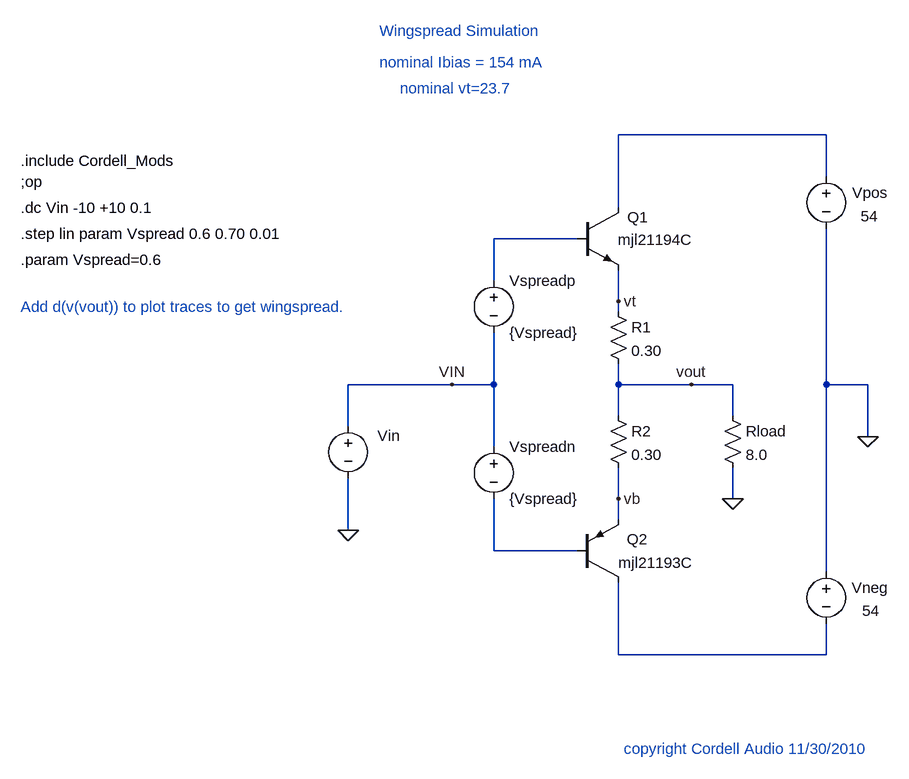
[diagram p0: schematic Wingspread.asc]
Wingspread.asc, the LTspice schematic file:
Version 4
SHEET 1 2428 1336
WIRE 320 240 0 240
WIRE 320 304 320 240
WIRE 0 352 0 240
WIRE -64 400 -192 400
WIRE -192 464 -192 400
WIRE 0 496 0 448
WIRE 0 512 0 496
WIRE -256 624 -416 624
WIRE -192 624 -192 544
WIRE -192 624 -256 624
WIRE 0 624 0 592
WIRE 112 624 0 624
WIRE 176 624 112 624
WIRE 320 624 320 384
WIRE 384 624 320 624
WIRE 0 672 0 624
WIRE 176 672 176 624
WIRE -416 688 -416 624
WIRE 384 704 384 624
WIRE -192 720 -192 624
WIRE 0 800 0 752
WIRE 176 800 176 752
WIRE 0 832 0 800
WIRE -416 848 -416 768
WIRE -192 880 -192 800
WIRE -64 880 -192 880
WIRE 320 912 320 624
WIRE 0 1040 0 928
WIRE 320 1040 320 992
WIRE 320 1040 0 1040
FLAG -416 848 0
FLAG -256 624 VIN
FLAG 176 800 0
FLAG 384 704 0
FLAG 112 624 vout
FLAG 0 496 vt
FLAG 0 800 vb
SYMBOL voltage -416 672 R0
WINDOW 123 -75 91 Left 0
WINDOW 39 0 0 Left 0
WINDOW 3 -256 104 Left 0
WINDOW 0 45 31 Left 0
SYMATTR Value ""
SYMATTR InstName Vin
SYMBOL voltage 320 288 R0
WINDOW 123 0 0 Left 0
WINDOW 39 0 0 Left 0
WINDOW 0 40 41 Left 0
WINDOW 3 53 77 Left 0
SYMATTR InstName Vpos
SYMATTR Value 54
SYMBOL res -16 496 R0
SYMATTR InstName R1
SYMATTR Value 0.30
SYMBOL voltage 320 896 R0
WINDOW 123 0 0 Left 0
WINDOW 39 0 0 Left 0
WINDOW 0 39 41 Left 0
WINDOW 3 55 76 Left 0
SYMATTR InstName Vneg
SYMATTR Value 54
SYMBOL voltage -192 448 R0
WINDOW 123 0 0 Left 0
WINDOW 39 0 0 Left 0
SYMATTR InstName Vspreadp
SYMATTR Value {Vspread}
SYMBOL res -16 656 R0
SYMATTR InstName R2
SYMATTR Value 0.30
SYMBOL voltage -192 704 R0
WINDOW 123 0 0 Left 0
WINDOW 39 0 0 Left 0
SYMATTR InstName Vspreadn
SYMATTR Value {Vspread}
SYMBOL res 160 656 R0
SYMATTR InstName Rload
SYMATTR Value 8.0
SYMBOL npn -64 352 R0
WINDOW 0 78 15 Left 0
WINDOW 3 63 49 Left 0
SYMATTR InstName Q1
SYMATTR Value mjl21194C
SYMBOL pnp -64 928 M180
WINDOW 0 77 66 Left 0
WINDOW 3 64 30 Left 0
SYMATTR InstName Q2
SYMATTR Value mjl21193C
TEXT -920 312 Left 0 !;op
TEXT -368 80 Left 0 ;Wingspread Simulation
TEXT -368 128 Left 0 ;nominal Ibias = 154 mA
TEXT -920 352 Left 0 !.dc Vin -10 +10 0.1
TEXT -920 504 Left 0 ;Add d(v(vout)) to plot traces to get wingspread.
TEXT -336 168 Left 0 ;nominal vt=23.7
TEXT -920 432 Left 0 !.param Vspread=0.6
TEXT -920 392 Left 0 !.step lin param Vspread 0.6 0.70 0.01
TEXT -920 280 Left 0 !.include Cordell_Mods
TEXT 8 1184 Left 0 ;copyright Cordell Audio 11/30/2010

The netlist it stands for:
* Wingspread.asc
Vin VIN 0
Vpos N001 0 54
R1 vt vout 0.30
Vneg 0 N004 54
Vspreadp N002 VIN {Vspread}
R2 vout vb 0.30
Vspreadn VIN N003 {Vspread}
Rload vout 0 8.0
Q1 N001 N002 vt 0 mjl21194C
Q2 N004 N003 vb 0 mjl21193C
.model NPN NPN
.model PNP PNP
.lib standard.bjt
;op
* Wingspread Simulation
* nominal Ibias = 154 mA
.dc Vin -10 +10 0.1
* Add d(v(vout)) to plot traces to get wingspread.
* nominal vt=23.7
.param Vspread=0.6
.step lin param Vspread 0.6 0.70 0.01
.include Cordell_Mods
* copyright Cordell Audio 11/30/2010
.backanno
.end